# EasyEDA schematic assignment NOVA TEAM light control system.json
TITLE: Sheet_1; REV: 1.0; Date: 2025-07-01; Sheet: 1/1; Drawn By: mbugaidi8; Company: Your Company
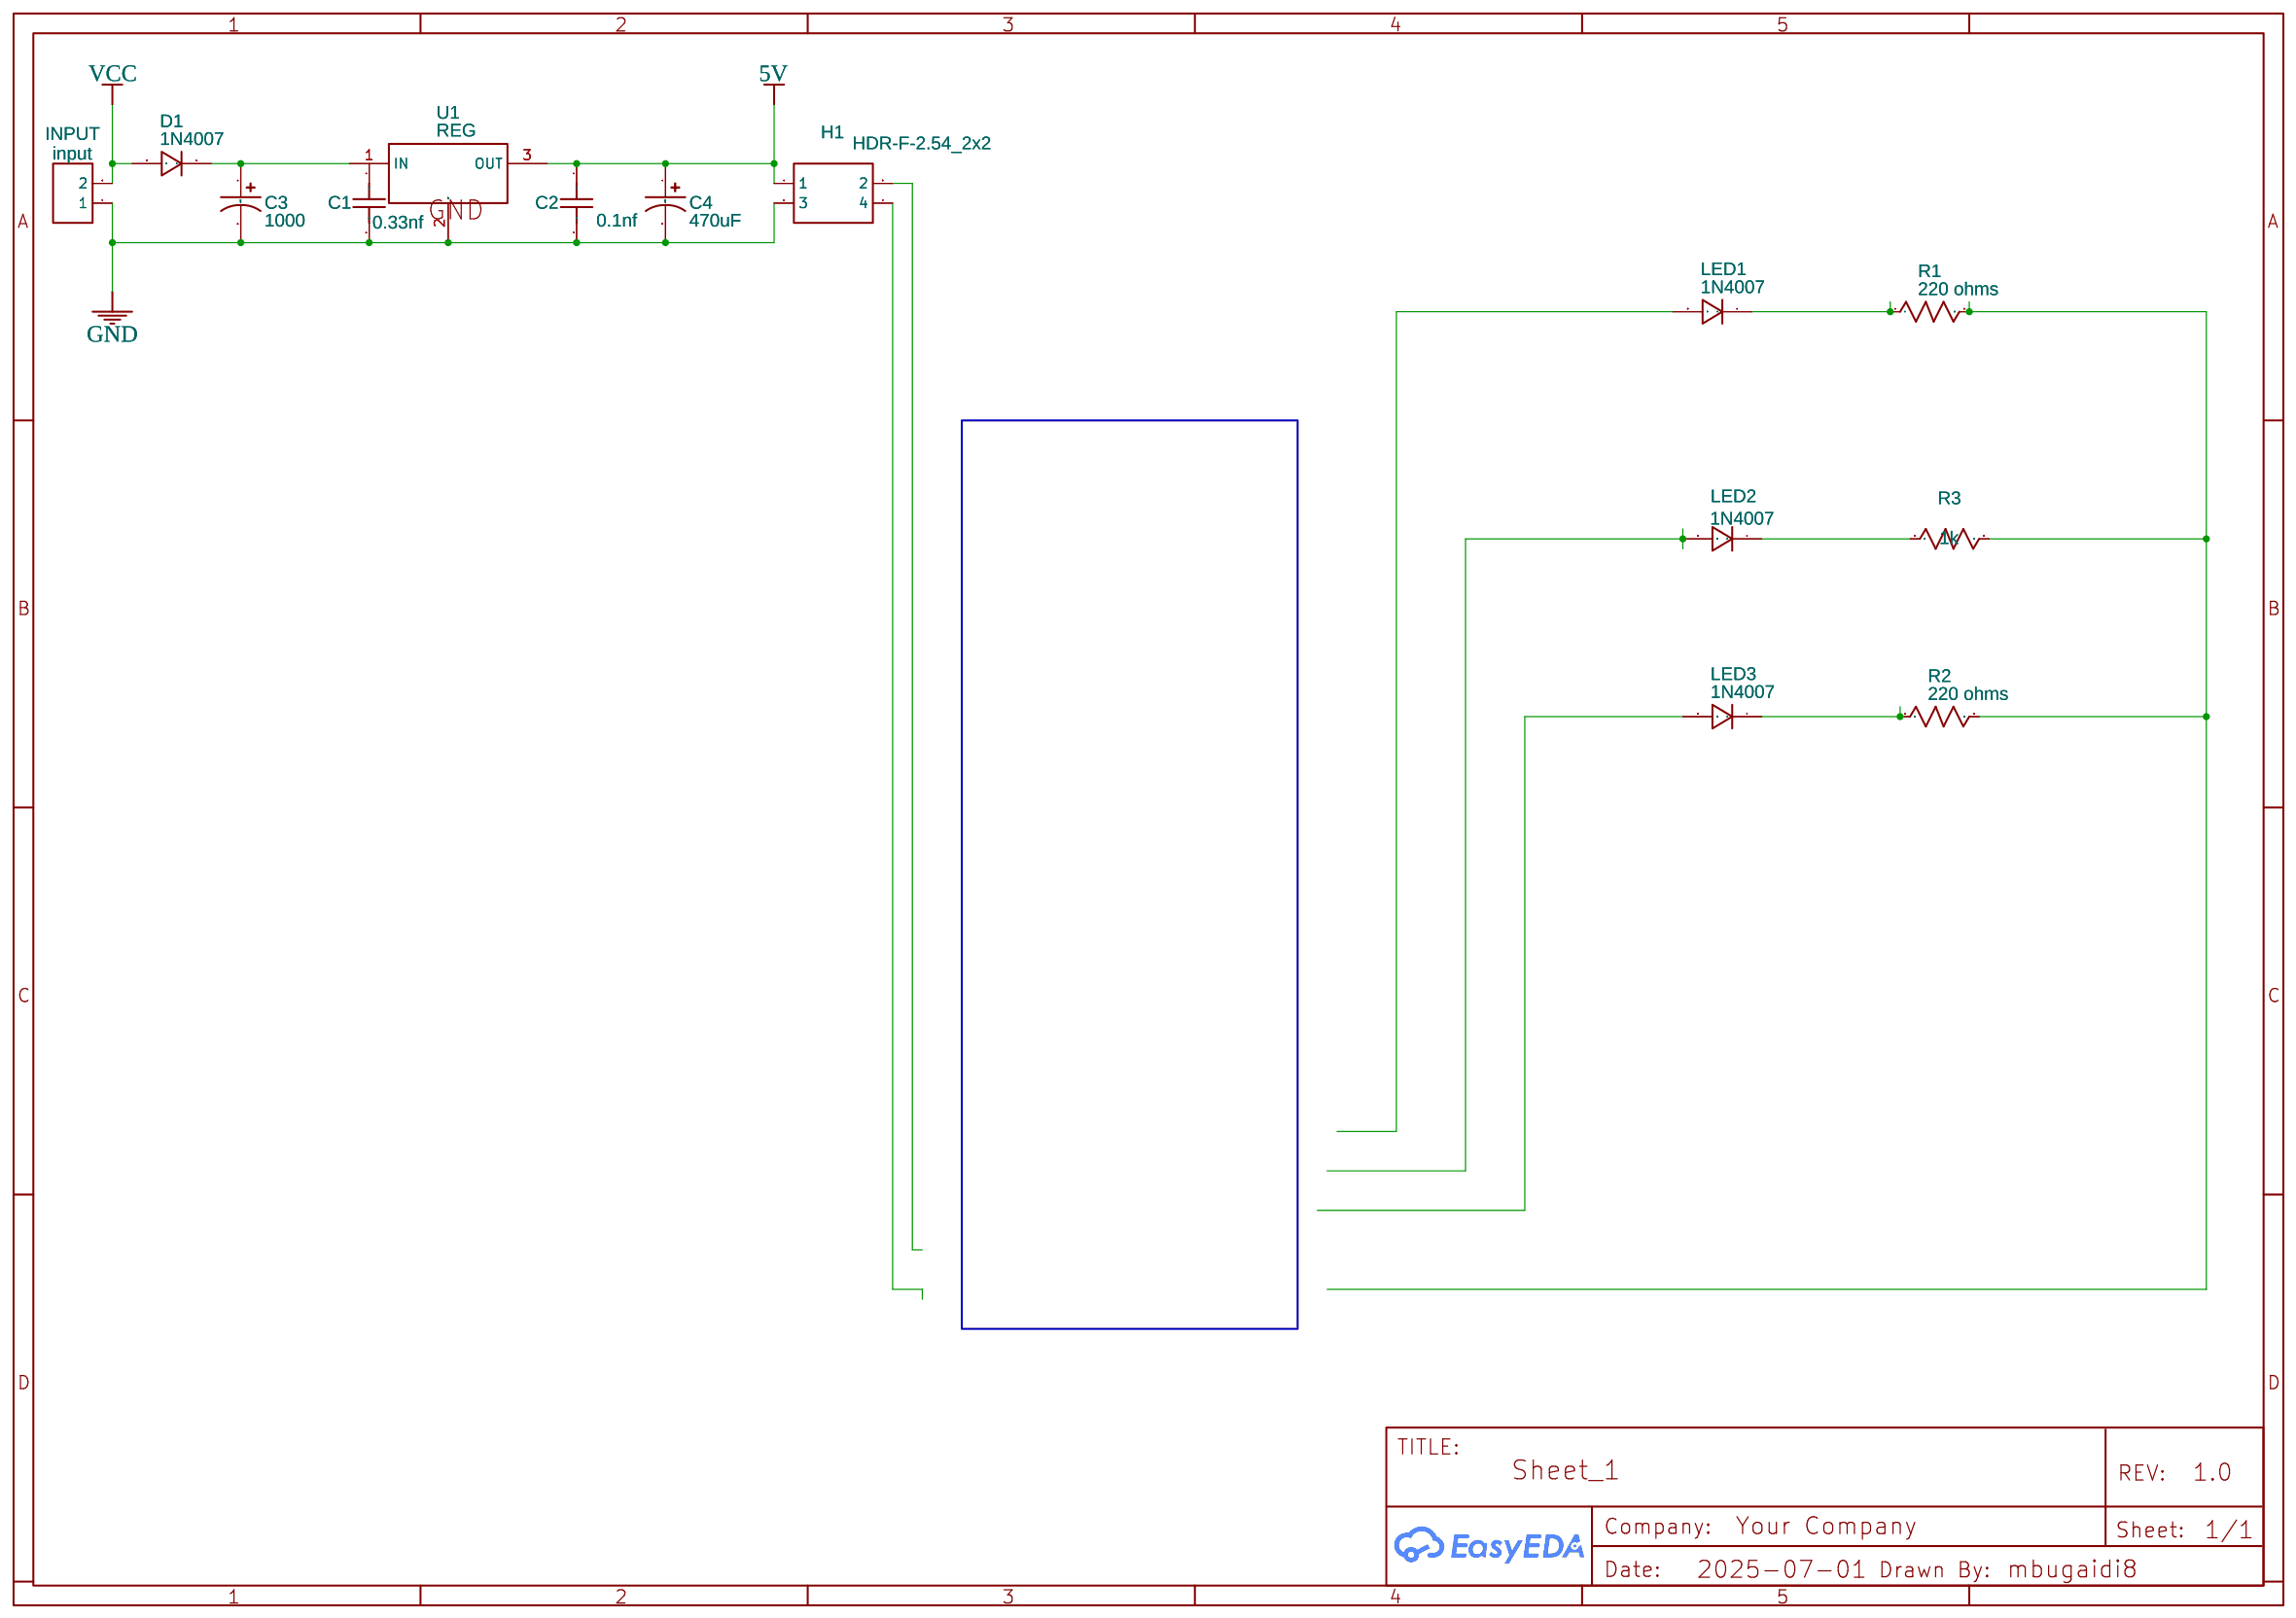
[diagram p0: schematic sheet]

## Parts
C1  0.33nf  [RAD-0.1]
C2  0.1nf  [RAD-0.1]
C3  1000  [CAP-D3.0×F1.5]
C4  470uF  [CAP-D3.0×F1.5]
D1  1N4007  [DO-41_BD2.4-L4.7-P8.70-D0.9-RD]
H1  HDR-F-2.54_2x2  [HDR-F-2.54_2X2]
INPUT  input  [CONN-TH_2P-P5.00]
LED1  1N4007  [DO-41_BD2.4-L4.7-P8.70-D0.9-RD]
LED2  1N4007  [DO-41_BD2.4-L4.7-P8.70-D0.9-RD]
LED3  1N4007  [DO-41_BD2.4-L4.7-P8.70-D0.9-RD]
R1  220 ohms  [R0603]
R2  220 ohms  [R0603]
R3  1k  [R0603]
U1  REG  [TO-220-3_L10.0-W4.5-P2.54-L]

## Library data of the parts
C1 C2 = C_RAD-0.1_US: Contributor: LCEDA_Lib
C3 C4 = CE_TH_D3.0×F1.5_US: Contributor: LCEDA_Lib
D1 LED1-LED3 = 1N4007: Supplier: LCSC; Manufacturer: SEMTECH; Supplier Part: C106903; Contributor: LCEDA_Lib
H1 = HDR-F-2.54_2x2: Supplier Part: C239342; Supplier: LCSC; Contributor: LCEDA_Lib
INPUT = CONN-TH_2P-P5.00: Supplier: LCSC; Contributor: LCEDA_Lib
R1-R3 = R_0603_US: Contributor: LCEDA_Lib
U1 = 7805(TO-220): Supplier: LCSC; Manufacturer: STMicroelectronics; Manufacturer Part: L7805CV-DG; Supplier Part: C3795; Contributor: LCEDA_Lib

## Nets
5V: C2.1 C4.1 H1.1 U1.3(OUT)
GND: C1.2 C2.2 C3.2 C4.2 H1.3 INPUT.1 U1.2(GND)
VCC: D1.2 INPUT.2
Net-(C3-1): C3.1 D1.1 U1.1(IN)
Net-(LED1-1): LED1.1 R1.1
Net-(LED2-1): LED2.1 R3.1
Net-(LED3-1): LED3.1 R2.1
Net-(R1-2): R1.2 R2.2 R3.2

Not connected (* = marked no-connect by the designer): C1 1; H1 2 4; LED1 2; LED2 2; LED3 2
